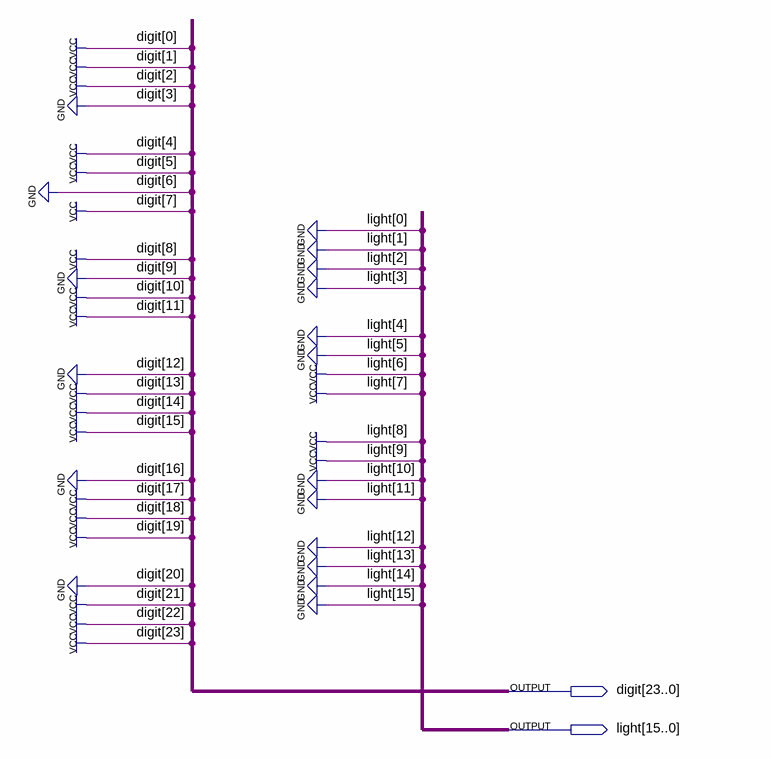
[diagram p0: schematic sheet]
// Quartus schematic Pattern_5_Frame_2.bdf as structural Verilog: 0 symbols, 2 pins
module Pattern_5_Frame_2 (
  output [23:0] digit,
  output [15:0] light
);


  assign digit = 24'b111011101110110110110111;
  assign light = 16'b0000001111000000;
endmodule
